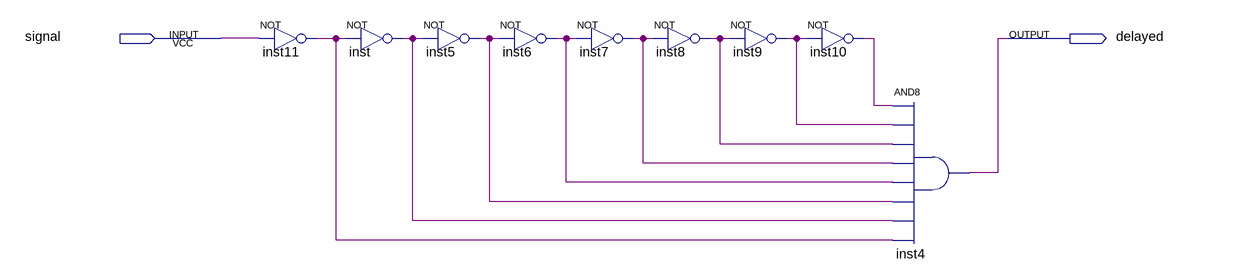
[diagram p0: schematic sheet]
// Quartus schematic delay-10.bdf as structural Verilog: 9 symbols, 2 pins
module \delay-10  (
  input  signal,
  output delayed
);

  wire inst5_out, inst6_out, inst7_out, inst8_out, inst9_out, inst10_out, inst11_out, inst_out;

  not inst11 (inst11_out, signal);
  not inst (inst_out, inst11_out);
  not inst5 (inst5_out, inst_out);
  not inst6 (inst6_out, inst5_out);
  not inst7 (inst7_out, inst6_out);
  not inst8 (inst8_out, inst7_out);
  not inst9 (inst9_out, inst8_out);
  not inst10 (inst10_out, inst9_out);
  and inst4 (delayed, inst10_out, inst9_out, inst8_out, inst7_out, inst6_out, inst5_out, inst_out, inst11_out);
endmodule
